# EAGLE design Lixie_Master (EAGLE 7.7.0)
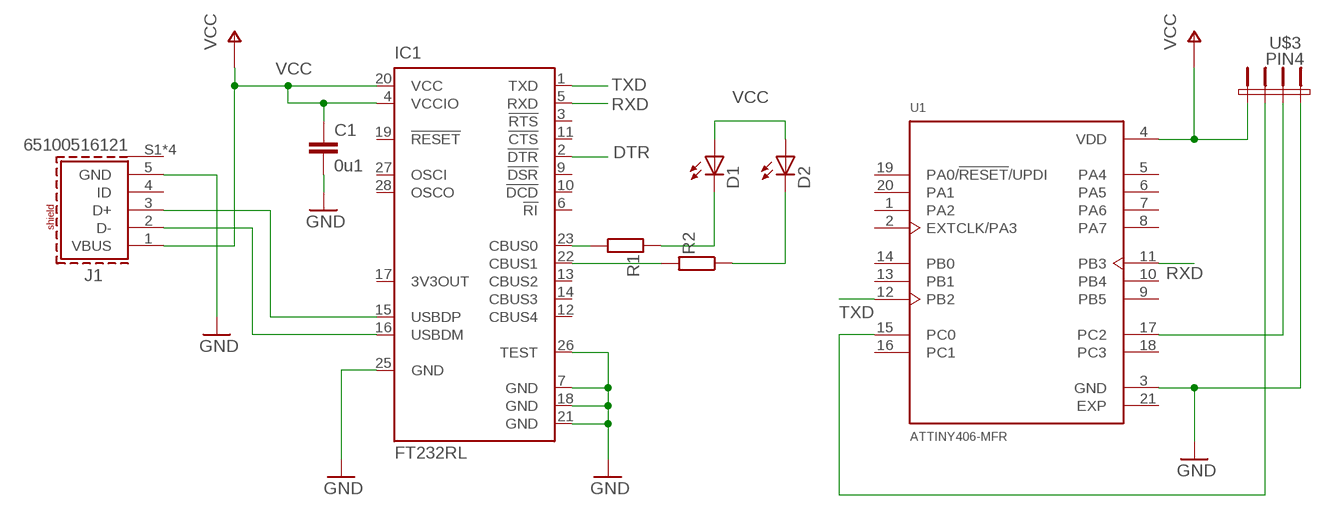
[diagram p0: schematic, sheet 1]

## Parts
C1  0u1  C-EUC0805  [C0805]
D1  LED1206  [1206]
D2  LED1206  [1206]
IC1  FT232RL  [SSOP28]
J1  65100516121  [65100516121]
R1  R0805  [R0805]
R2  R0805  [R0805]
U1  ATTINY406-MFR  [QFN40P300X300X90-21N]
U$3  PIN4  [PIN4_P]

## Nets
DTR: IC1.2(!DTR)
GND: C1.2 IC1.7(GND) IC1.18(GND) IC1.21(GND) IC1.25(GND) IC1.26(TEST) J1.5(GND) U1.3(GND) U$3.4
N$1: IC1.15(USBDP) J1.3(D+)
N$2: IC1.16(USBDM) J1.2(D-)
N$3: IC1.23(CBUS0) R1.1
N$5: D1.C R1.2
N$6: IC1.22(CBUS1) R2.2
N$7: D2.C R2.1
N$8: U1.15(PC0) U$3.2
N$9: U1.17(PC2) U$3.3
RXD: IC1.5(RXD) U1.11(PB3)
TXD: IC1.1(TXD) U1.12(PB2)
VCC: C1.1 D1.A D2.A IC1.4(VCCIO) IC1.20(VCC) J1.1(VBUS) U1.4(VDD) U$3.1
Unconnected: IC1.3(!RTS) IC1.6(!RI) IC1.9(!DSR) IC1.10(!DCD) IC1.11(!CTS) IC1.12(CBUS4) IC1.13(CBUS2) IC1.14(CBUS3) IC1.17(3V3OUT) IC1.19(!RESET) IC1.27(OSCI) IC1.28(OSCO) J1.4(ID) J1.S1(SHIELD) J1.S2(SHIELD) J1.S3(SHIELD) J1.S4(SHIELD) U1.1(PA2) U1.2(EXTCLK/PA3) U1.5(PA4) U1.6(PA5) U1.7(PA6) U1.8(PA7) U1.9(PB5) U1.10(PB4) U1.13(PB1) U1.14(PB0) U1.16(PC1) U1.18(PC3) U1.19(PA0/!RESET!/UPDI) U1.20(PA1)

## Power pins joined to a net without a drawn wire
EXP: U1.21(EXP)

## Library data of the parts
C1 = 0_HTL_MegaCard_V3:C-EU: CAPACITOR, European symbol
D1 D2 = 0_HTL_analog:LED*: LED
IC1 = ftdichip:FT232R: Source: http://www.ftdichip.com/Documents/DataSheets/DS_FT232R_v104.pdf; MPN: FT232RL; OC_FARNELL: 1146032; OC_NEWARK: 91K9918
J1 = 65100516121:65100516121: WR-COM Mini USB 2.0 Type B SMT Horizontal 5 Contacts Kind Properties Durability:1 500 Mating cycles Quality Class:1 500 Mating cycles Connector Type:Mini USB Gender:Receptacle Type:Horizontal General Information Operating Temperature:-40up to +105 °C Compliance:RoHS Electrical Properties IR 1:1A Working Voltage:30V (AC) Withstanding Voltage:750V (AC) Contact Resistance:20 mΩ Material Properties Insulator Material:LCP Insulator Flammability Rating:UL94 V-0 Color:Black Cover Material:Brass Cover Plating:Nickel Contact Material:Copper Alloy Contact Plating: Selective Gold Contact Type:Stamped Shielding Material:Brass Shielding Plating:Nickel <https://www.we-online.com/catalog/media/o33005v209%20Family_WR-COM_65100516121.jpg> Details see: https://www.we-online.com/catalog/en/COM_SMT_MINI_TYPE_B_HORIZONTAL/ Updated by Yingchun, Shan 2020-01-16 2020 (C) Würth Elektronik Check availability <https://pricing.snapeda.com/parts/65100516121/W%C3%BCrth%20Elektronik/view-part?ref=eda>; AVAILABILITY: In Stock; DESCRIPTION: USB - mini B USB 2.0 Receptacle Connector 5 Position Surface Mount, Right Angle; MF: Würth Elektronik; MP: 65100516121; PACKAGE: None; PRICE: None; PURCHASE-URL: https://pricing.snapeda.com/search/part/65100516121/?ref=eda
R1 R2 = 0_HTL_analog:R: Widerstand
U1 = ATTINY406-MFR:ATTINY406-MFR: ATtiny Series 4 KB Flash 256 B RAM 20 MHz 8-Bit Microcontroller - VQFN-20 Check availability <https://pricing.snapeda.com/parts/ATTINY406-MFR/Microchip/view-part?ref=eda>; AVAILABILITY: In Stock; DESCRIPTION: AVR AVR® ATtiny, Functional Safety (FuSa) Microcontroller IC 8-Bit 20MHz 4KB (4K x 8) FLASH 20-VQFN (3x3); MF: Microchip; MP: ATTINY406-MFR; PACKAGE: VQFN-20 Microchip; PRICE: None; PURCHASE-URL: https://pricing.snapeda.com/search/part/ATTINY406-MFR/?ref=eda
U$3 = zkseagle:PIN4

## Board
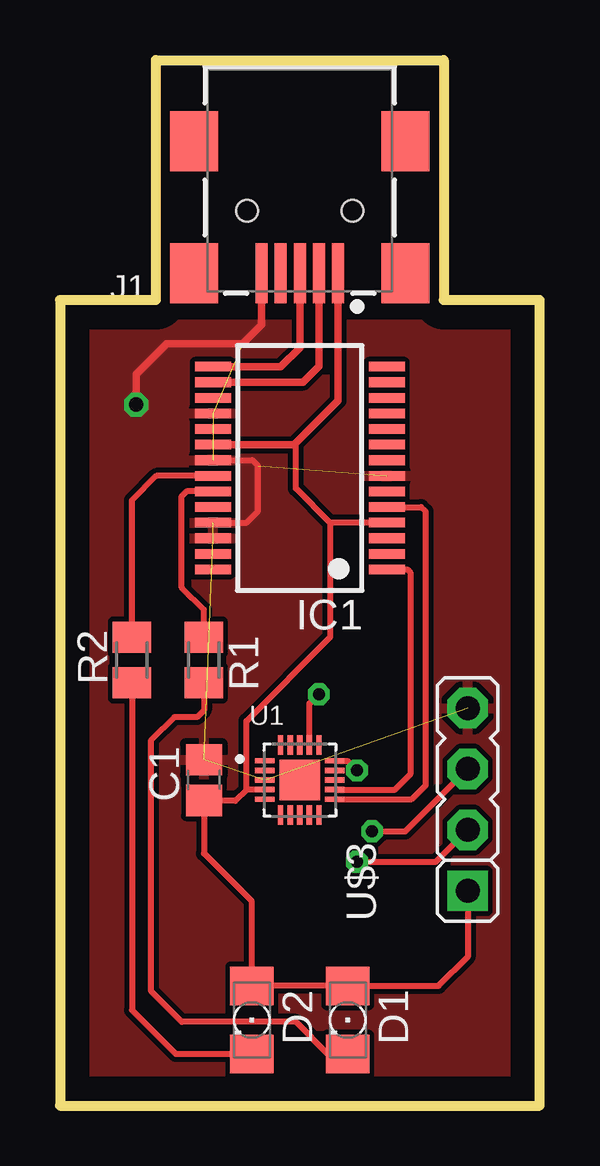
[diagram p1: board, top side]
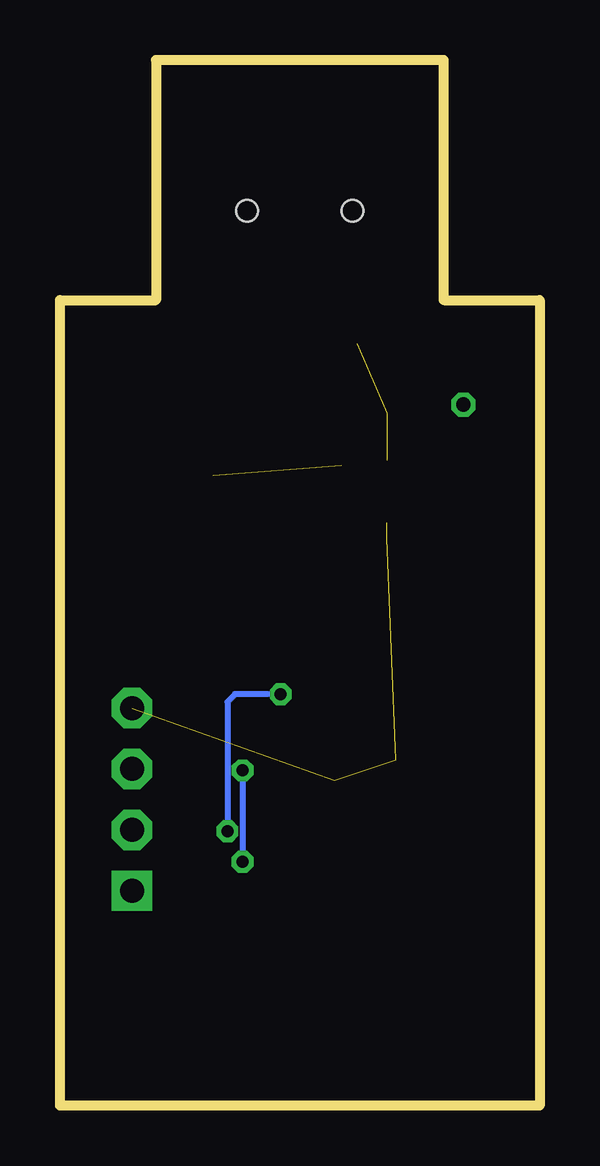
[diagram p2: board, bottom side, seen from below]

Size 20 x 43.57 mm. Coordinates in mm from the lower left corner, seen from the top.
Outline: 0,0 20,0 20,33.57 16,33.57 16,43.57 4,43.57 4,33.57 0,33.57 0,0
Copper layers (1*16): Top 0.035mm / dielectric 1.5mm / Bottom 0.035mm
Design rules "default *": minimum track width 10mil, minimum drill 24mil, track to track 8mil, track to pad 8mil, pad to pad 8mil, via to via 8mil, smd to smd 8mil, copper to edge 40mil, drill to drill 8mil, minimum pad ring 10mil, minimum via ring 8mil, stop-mask expansion 4mil, vias tented up to drill 0mil, thermal gap 10mil

### Footprints (pad centres in the part's own frame; a part is rotated, then mirrored left to right if it is on the bottom)
C0805 = smd 1.3 x 1.5: 1 -0.85,0; 2 0.85,0
1206 = smd 1.6 x 1.803: A -1.422,0; C 1.422,0
SSOP28 = smd 0.4 x 1.5: 1 -4.225,-3.625; 2 -3.575,-3.625; 3 -2.925,-3.625; 4 -2.275,-3.625; 5 -1.625,-3.625; 6 -0.975,-3.625; 7 -0.325,-3.625; 8 0.325,-3.625; 9 0.975,-3.625; 10 1.625,-3.625; 11 2.275,-3.625; 12 2.925,-3.625; 13 3.575,-3.625; 14 4.225,-3.625; 15 4.225,3.625; 16 3.575,3.625; 17 2.925,3.625; 18 2.275,3.625; 19 1.625,3.625; 20 0.975,3.625; 21 0.325,3.625; 22 -0.325,3.625; 23 -0.975,3.625; 24 -1.625,3.625; 25 -2.275,3.625; 26 -2.925,3.625; 27 -3.575,3.625; 28 -4.225,3.625
65100516121 = smd 0.5 x 2.5: 1 -1.6,3.875; 2 -0.8,3.875; 3 0,3.875; 4 0.8,3.875; 5 1.6,3.875 | smd 2 x 2.5: S1 -4.4,3.875; S2 4.4,3.875; S3 4.4,-1.625; S4 -4.4,-1.625 | hole 0.9: -2.2,1.275; 2.2,1.275
R0805 = smd 1.3 x 1.6: 1 -0.95,0; 2 0.95,0
QFN40P300X300X90-21N = smd 0.81 x 0.22: 1 -1.45,0.8; 2 -1.45,0.4; 3 -1.45,0; 4 -1.45,-0.4; 5 -1.45,-0.8; 11 1.45,-0.8; 12 1.45,-0.4; 13 1.45,0; 14 1.45,0.4; 15 1.45,0.8 | smd 0.22 x 0.81: 6 -0.8,-1.45; 7 -0.4,-1.45; 8 0,-1.45; 9 0.4,-1.45; 10 0.8,-1.45; 16 0.8,1.45; 17 0.4,1.45; 18 0,1.45; 19 -0.4,1.45; 20 -0.8,1.45 | smd 1.7 x 1.7: 21 0,0
PIN4_P = drill 1 pad 1.676 square: 1 -7.62,0 | drill 1 pad 1.676 octagon: 2 -5.08,0; 3 -2.54,0; 4 0,0

### Placement (x,y rotation side)
C1  6,13.57 90 top
D1  12,3.57 270 top
D2  8,3.57 270 top
IC1  10,26.57 90 top
J1  10,38.57 180 top
R1  6,18.57 270 top
R2  3,18.57 90 top
U1  10,13.57 0 top
U$3  17,16.57 90 top

### Tracks (layer width: path | path; a pad name or v marks a point on that pad's centre or on a via)
GND  (via drill 0.6)  (7 unrouted)
  Top 0.254: IC1.25 7.79,24.3 8.26,24.77 8.26,26.67 8.03,26.89 IC1.21
  Top 0.305: J1.5 8.4,32.53 7.62,31.75 4.45,31.75 3.17,30.48 v3.17,29.21
  pour Top: 1,32.57 19,32.57 19,1 1,1
N$1
  Top 0.305: J1.3 10,31.59 9.21,30.8 IC1.15
N$2
  Top 0.305: J1.2 10.8,30.8 10.14,30.14 IC1.16
N$3
  Top 0.254: R1.1 6,20.67 5.08,21.59 5.08,25.4 5.28,25.59 IC1.23
N$5
  Top 0.254: R1.2 6,16.48 5.71,16.19 4.76,16.19 3.81,15.24 3.81,4.76 5.08,3.49 9.84,3.49 11.19,2.15 D1.C
N$6
  Top 0.254: IC1.22 4.02,26.25 3,25.23 R2.2
N$7
  Top 0.254: R2.1 3,3.98 4.84,2.15 D2.C
N$8  (via drill 0.5)
  Top 0.254: U1.15 11.98,14.37 v12.38,13.97 | v12.38,10.16 15.67,10.16 U$3.2
  Bottom 0.254: v12.38,13.97 v12.38,10.16
N$9  (via drill 0.5)
  Top 0.254: U1.17 10.4,16.75 v10.79,17.14 | v13.02,11.43 14.4,11.43 U$3.3
  Bottom 0.254: v10.79,17.14 12.7,17.14 13.02,16.83 v13.02,11.43
RXD
  Top 0.254: IC1.5 15.06,24.95 15.24,24.77 15.24,13.34 14.68,12.77 U1.11
TXD
  Top 0.254: U1.12 13.97,13.17 14.61,13.8 14.61,22.23 14.48,22.34 IC1.1
VCC
  Top 0.254: IC1.4 11.27,24.3 | 11.27,24.3 9.84,25.72 9.84,27.47 9.77,27.55 | U1.4 7.77,13.17 | 7.77,13.17 7.3,12.7 6.02,12.7 C1.1 6,10.51 8,8.51 D2.A D1.A 15.79,4.99 17,6.21 U$3.1 | 11.27,24.3 11.27,19.52 7.77,16.03 7.77,13.17
  Top 0.305: J1.1 11.6,29.38 9.77,27.55 IC1.20